# EAGLE schematic powerstage (EAGLE 9.2.2)
Assembly variants: BASIC
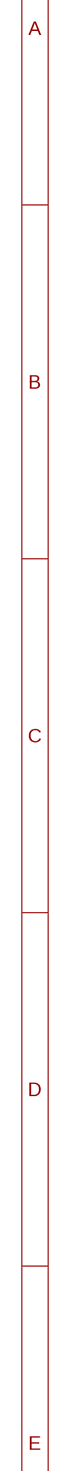
[diagram p0: schematic, sheet 1, part 1 of 2]
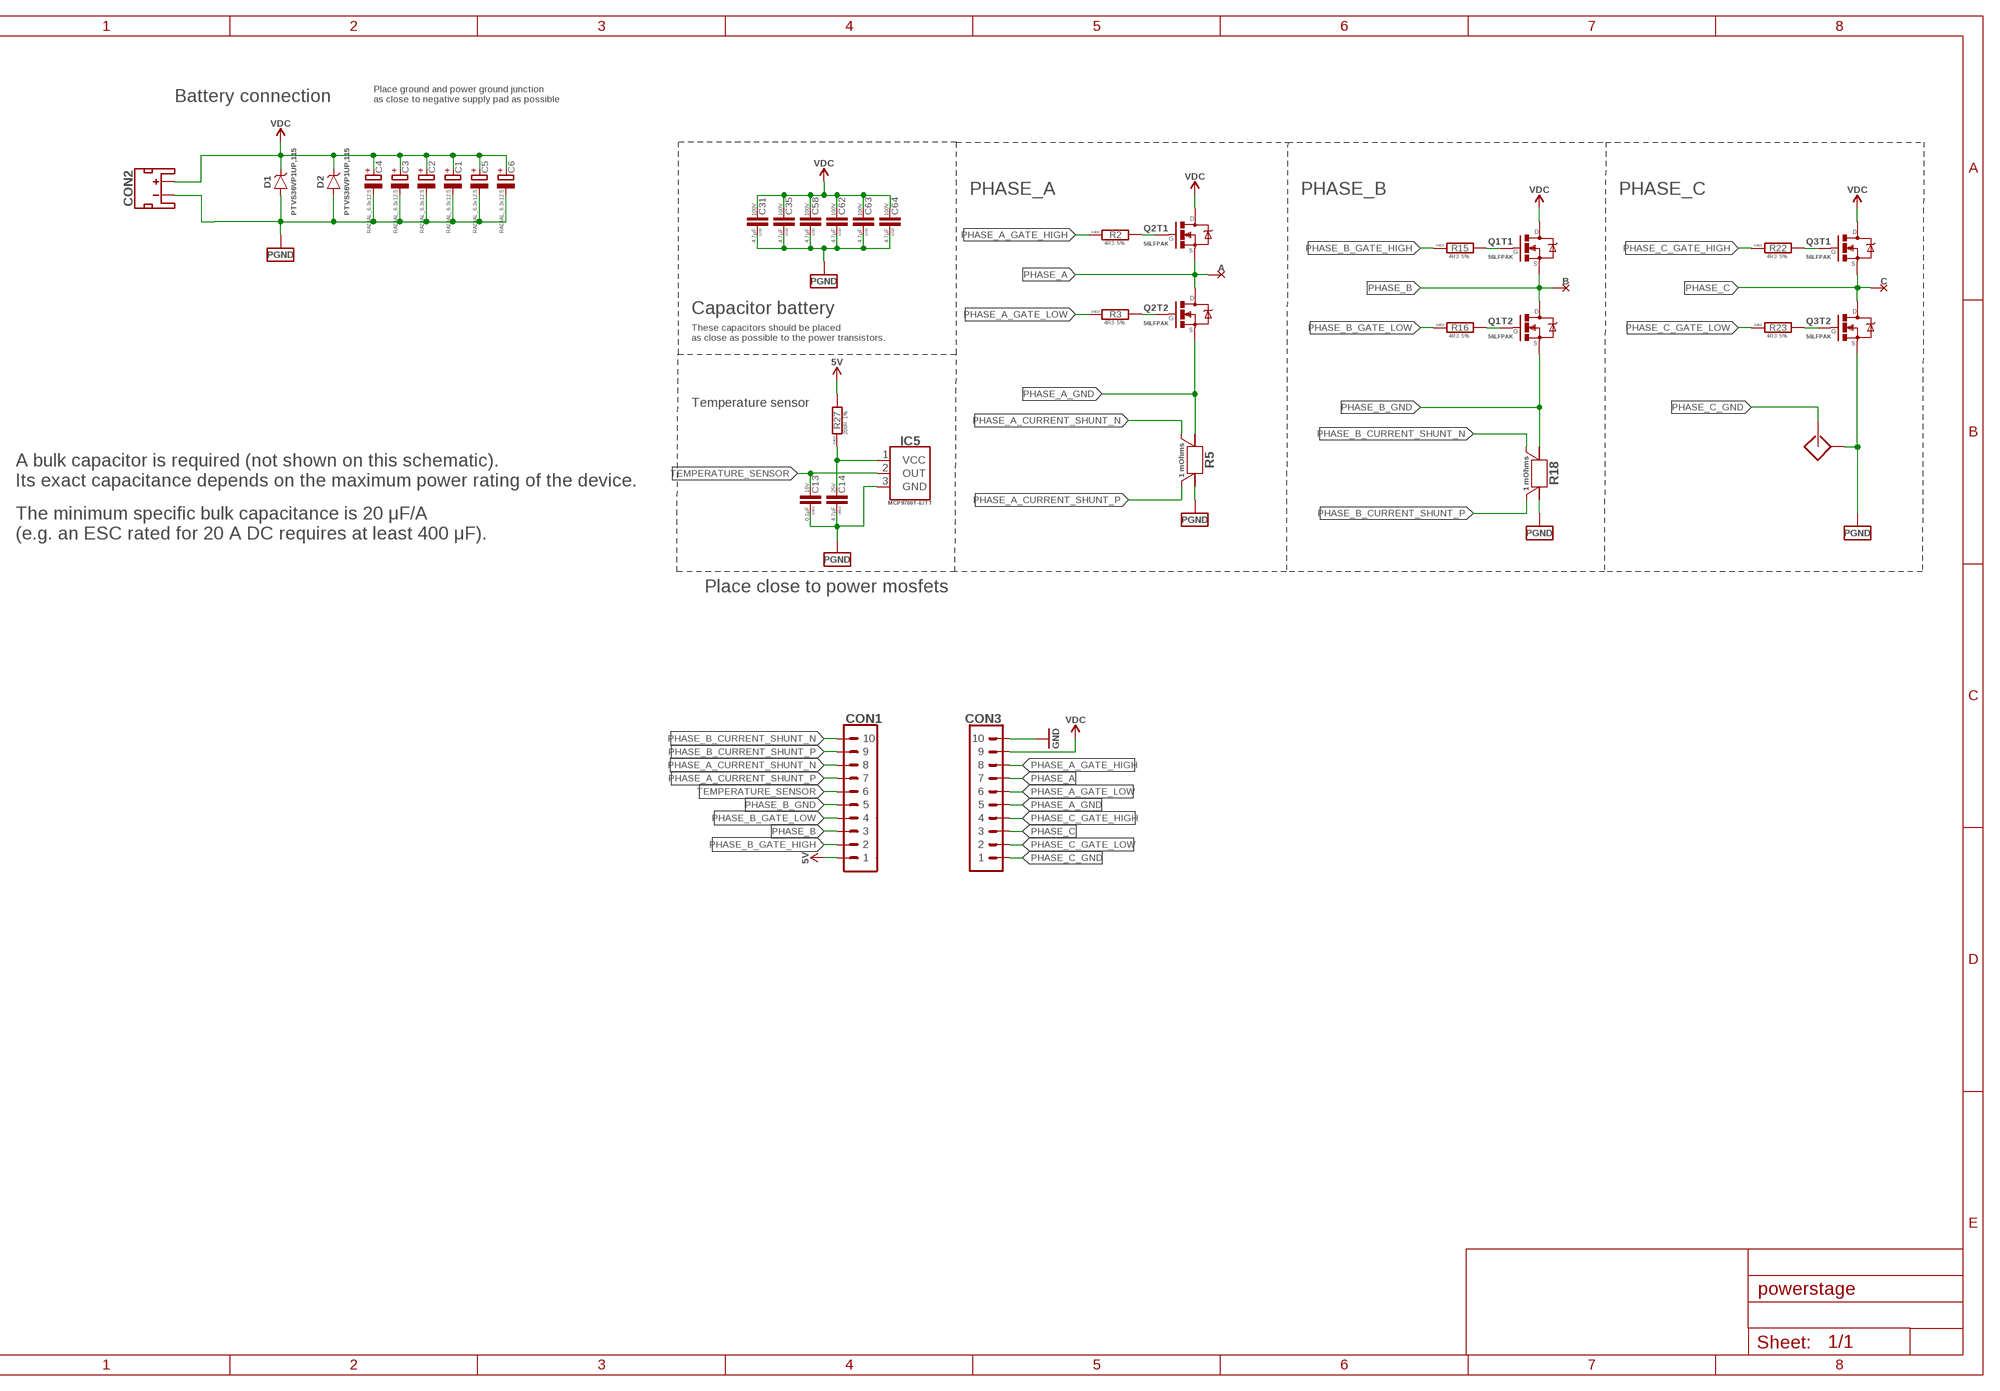
[diagram p1: schematic, sheet 1, part 2 of 2]

## Parts
A  PAD-HOLE_2  [HOLE_2]  (not fitted in variant BASIC)
B  PAD-HOLE_2  [HOLE_2]  (not fitted in variant BASIC)
C  PAD-HOLE_2  [HOLE_2]  (not fitted in variant BASIC)
C1  CPOLRADIAL-6.3X12.5-RA  [RADIAL_6.3X12.5-RA]
C2  CPOLRADIAL-6.3X12.5-RA  [RADIAL_6.3X12.5-RA]
C3  CPOLRADIAL-6.3X12.5-RA  [RADIAL_6.3X12.5-RA]
C4  CPOLRADIAL-6.3X12.5-RA  [RADIAL_6.3X12.5-RA]
C5  CPOL-RADIAL_6.3X12.5  [RADIAL_6.3X12.5]
C6  CPOL-RADIAL_6.3X12.5  [RADIAL_6.3X12.5]
C13  0.1µF  0.1µF-16V_10%_X7R-0402  [C0402]
C14  4.7µF  4.7µF-25V_10%_X6S-0603  [C0603]
C31  4.7µF  4.7µF-100V_20%_X7S-1210  [C1210]
C35  4.7µF  4.7µF-100V_20%_X7S-1210  [C1210]
C58  4.7µF  4.7µF-100V_20%_X7S-1210  [C1210]
C62  4.7µF  4.7µF-100V_20%_X7S-1210  [C1210]
C63  4.7µF  4.7µF-100V_20%_X7S-1210  [C1210]
C64  4.7µF  4.7µF-100V_20%_X7S-1210  [C1210]
CON1  PINHEAD_1X10-2-FEMALE  [1X10-PTH_2-FEMALE]
CON2  BATTERY_CON-2P-XT30-RA  [XT30-RA]
CON3  PINHEAD_1X10-2-FEMALE  [1X10-PTH_2-FEMALE]
D1  PTVS36VP1UP,115-36V-SOD128  [SOD128]
D2  PTVS36VP1UP,115-36V-SOD128  [SOD128]
IC5  MCP9700  [SOT23B-3]
Q1  BUK7K6R2-40EX  [SOT-1205]
Q2  BUK7K6R2-40EX  [SOT-1205]
Q3  BUK7K6R2-40EX  [SOT-1205]
R2  4R3  4R3-5%-0402  [R0402]
R3  4R3  4R3-5%-0402  [R0402]
R5  1 mOhms  CURRENT_SHUNT_KELVIN-0.001R-2512-KELVIN  [R2512-KELVIN]
R15  4R3  4R3-5%-0402  [R0402]
R16  4R3  4R3-5%-0402  [R0402]
R18  1 mOhms  CURRENT_SHUNT_KELVIN-0.001R-2512-KELVIN  [R2512-KELVIN]
R22  4R3  4R3-5%-0402  [R0402]
R23  4R3  4R3-5%-0402  [R0402]
R27  200R  200R-1%-0402  [R0402]
S1  SENSE  [SENSE-0.6]  (not fitted in variant BASIC)

## Nets
GND: CON3.10
N$1 [HV]: Q2.2(T1:G) R2.2
N$2: Q2.4(T2:G) R3.2
N$3: Q1.2(T1:G) R15.2
N$4: Q1.4(T2:G) R16.2
N$10: C14.P$2 IC5.1(VCC) R27.1
N$12 [HV]: Q3.2(T1:G) R22.2
N$13: Q3.4(T2:G) R23.2
PGND: C1.- C2.- C3.- C4.- C5.- C6.- C13.1 C14.P$1 C31.1 C35.1 C58.1 C62.1 C63.1 C64.1 CON2.- D1.A D2.A IC5.3(GND) Q3.3(T2:S) R5.2 R5.22 R18.2 R18.22 S1.SHELL(SHELLL)
PHASE_A [HV]: A.P$1 CON3.7 Q2.1(T1:S) Q2.5(T2:D) Q2.6(T2:D) Q2.EP-5-6(T2:D)
PHASE_A_CURRENT_SHUNT_N: CON1.8 R5.S1
PHASE_A_CURRENT_SHUNT_P: CON1.7 R5.S2
PHASE_A_GATE_HIGH [HV]: CON3.8 R2.1
PHASE_A_GATE_LOW: CON3.6 R3.1
PHASE_A_GND: CON3.5 Q2.3(T2:S) R5.1 R5.11
PHASE_B [HV]: B.P$1 CON1.3 Q1.1(T1:S) Q1.5(T2:D) Q1.6(T2:D) Q1.EP-5-6(T2:D)
PHASE_B_CURRENT_SHUNT_N: CON1.10 R18.S1
PHASE_B_CURRENT_SHUNT_P: CON1.9 R18.S2
PHASE_B_GATE_HIGH [HV]: CON1.2 R15.1
PHASE_B_GATE_LOW: CON1.4 R16.1
PHASE_B_GND: CON1.5 Q1.3(T2:S) R18.1 R18.11
PHASE_C [HV]: C.P$1 CON3.3 Q3.1(T1:S) Q3.5(T2:D) Q3.6(T2:D) Q3.EP-5-6(T2:D)
PHASE_C_GATE_HIGH [HV]: CON3.4 R22.1
PHASE_C_GATE_LOW: CON3.2 R23.1
PHASE_C_GND: CON3.1 S1.IN
TEMPERATURE_SENSOR: C13.2 CON1.6 IC5.2(OUT)
VDC [HV]: C1.+ C2.+ C3.+ C4.+ C5.+ C6.+ C31.2 C35.2 C58.2 C62.2 C63.2 C64.2 CON2.+ CON3.9 D1.C D2.C Q1.7(T1:D) Q1.8(T1:D) Q1.EP-7-8(T1:D) Q2.7(T1:D) Q2.8(T1:D) Q2.EP-7-8(T1:D) Q3.7(T1:D) Q3.8(T1:D) Q3.EP-7-8(T1:D)
VDD_5V: CON1.1 R27.2 ; supply symbol labelled 5V
Unconnected: CON2.P$3(PAD1) CON2.P$4(PAD2)

## Notes on the sheet
- Battery connection
- Place ground and power ground junction
  as close to negative supply pad as possible
- PHASE_A | PHASE_B | PHASE_C
- Capacitor battery
- These capacitors should be placed 
  as close as possible to the power transistors.
- Temperature sensor
- A bulk capacitor is required (not shown on this schematic).
  Its exact capacitance depends on the maximum power rating of the device.
- The minimum specific bulk capacitance is 20 μF/A 
  (e.g. an ESC rated for 20 A DC requires at least 400 μF).
- Place close to power mosfets

## Library data of the parts
A B C = PADS:PAD; BOM: EXCLUDE
C1-C6 = rc:CPOL: Polar tantalum capacitor; PACKAGE: RADIAL_6.3x12.5
C13 = C_digikey:0.1µF; DIGIKEY#: 490-3261-1-ND; MANF: Murata Electronics North America; MANF#: GRM155R71C104KA88D; OPERATING_TEMP: -55°C ~ 125°C; PACKAGE: 0402; TC: X7R; TOLERANCE: +-10%; VOLTAGE: 16V
C14 = C_digikey:4.7µF; DIGIKEY#: 490-7199-1-ND; MANF: Murata Electronics North America; MANF#: GRM188C81E475KE11D; OPERATING_TEMP: -55°C ~ 105°C; PACKAGE: 0603; TC: X6S; TOLERANCE: +-10%; VOLTAGE: 25V
C31 C35 C58 C62-C64 = myxa_masterlib:4.7µF; DIGIKEY#: 445-6043-1-ND; MANF: TDK Corporation; MANF#: C3225X7S2A475M200AB; OPERATING_TEMP: -55°C ~ 125°C; PACKAGE: 1210; TC: X7S; TOLERANCE: +-20%; VOLTAGE: 100V
CON1 CON3 = pinhead:PINHEAD_1X10
CON2 = Connectors:BATTERY_CON-2P; LINK: https://www.tme.eu/en/details/xt30pw-m/dc-power-connectors/amass/; MANF: AMASS; MANF#: XT30PW-M
D1 D2 = TVS_diodes:PTVS36VP1UP,115: TVS DIODE CFP5; DIGIKEY#: 1727-4439-2-ND; MANF: Nexperia USA Inc; MANF#: PTVS36VP1UP,115
IC5 = myxa_masterlib:MCP9700: SENSOR TEMP ANLG VOLT SOT-23-3; DIGIKEY#: MCP9700T-E/TTTR-ND; MANF: Microchip Technology; MANF#: MCP9700T-E/TT
Q1-Q3 = mosfet:BUK7K6R2-40EX: MOSFET 2N-CH 40V 40A 56LFPAK; DIGIKEY#: 568-11626-1-ND; MANF: NXP Semiconductors; MANF#: BUK7K6R2-40EX; PACKAGE: 56LFPAK
R2 R3 R15 R16 R22 R23 = R_digikey:4R3; DIGIKEY#: 311-4.3JRCT-ND; MANF: Yageo; MANF#: RC0402JR-074R3L; PACKAGE: 0402; TOLERANCE: 5%
R5 R18 = SHUNT_RESISTORS:CURRENT_SHUNT_KELVIN; DIGIKEY#: CSNL2512FT1L00TR-ND; MANF: Stackpole Electronics Inc.; MANF#: CSNL2512FT1L00; POWER: 2W; TC: ±50ppm/°C; TOLERANCE: ±1%
R27 = R_digikey:200R; DIGIKEY#: 311-200LRCT-ND; MANF: Yageo; MANF#: RC0402FR-07200RL; PACKAGE: 0402; TOLERANCE: 1%
S1 = misc:SENSE; BOM: EXCLUDE

## Net classes
1 HV: clearance 0.25 mm to class 0, clearance 0.25 mm